# Altium schematic sheet 万年历.SchDoc
size A4
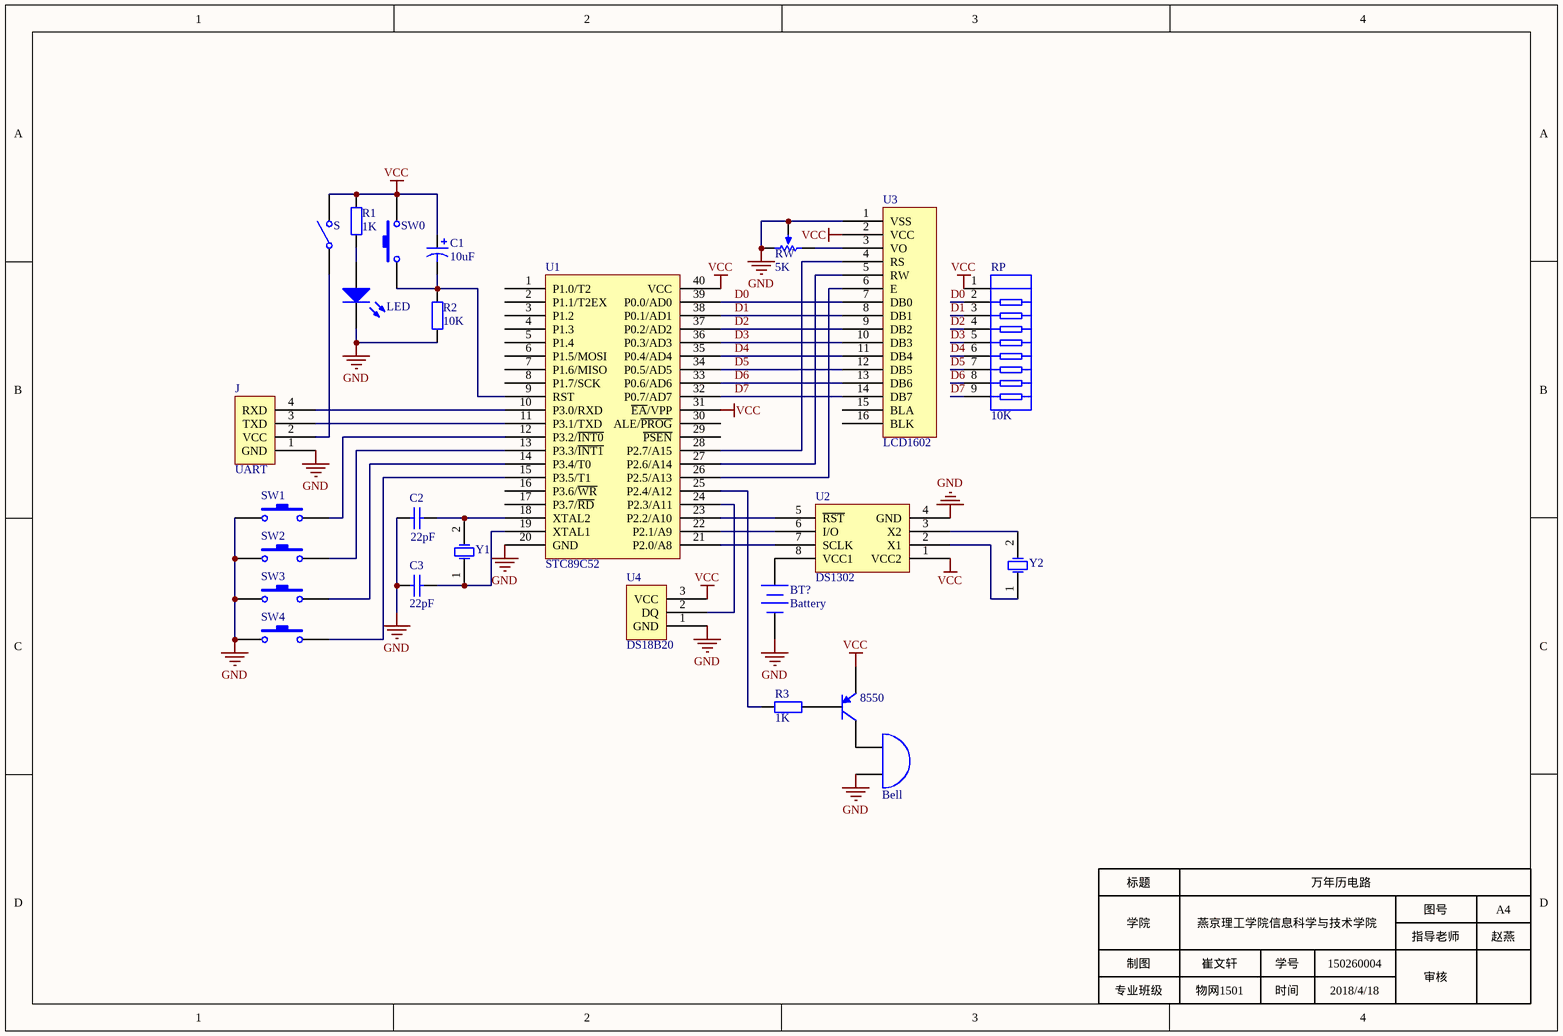
[diagram p0: 万年历.SchDoc]

## Parts
10K  RP  [HDR1X9]
8550  2N3906  [SOT_23_BCE]  (value not drawn)
?  LED  [1206-LED]
BT?  Battery  [BAT-2]
C1  value 10uF  [c+]  (hidden comment: Cap Pol1)
C2  value 22pF  [0805-C]  (hidden comment: Cap)
C3  value 22pF  [0805-C]  (hidden comment: Cap)
J  UART  [HDR1X4]
LS?  Bell  [RB7.6-15]
R1  value 1K  [0805-R]  (hidden comment: Res2)
R2  value 10K  [0805-R]  (hidden comment: Res2)
R3  value 1K  [0805-R]  (hidden comment: Res2)
RW  value 5K  [VR5]  (hidden comment: RPot)
S  SW-SPST  [KEY]  (value not drawn)
SW0  SW-PB  [SW]  (value not drawn)
SW1  SW-PB  [SW]  (value not drawn)
SW2  SW-PB  [SW]  (value not drawn)
SW3  SW-PB  [SW]  (value not drawn)
SW4  SW-PB  [SW]  (value not drawn)
U1  STC89C52  [STC89C52]
U2  DS1302  [SO8_N]
U3  LCD1602  [LCD1602]
U4  DS18B20  [HDR1X3]
Y1  XTAL  [XTAL-11.0592M]  (value not drawn)
Y2  XTAL  [XTAL-32.768K]  (value not drawn)

## Nets
GND: ?.2(K) BT?.2(-) C2.1 C3.1 J.1(GND) LS?.2(B) R2.2 RW.2(BOT) RW.3(TAP) SW1.1 SW2.1 SW3.1 SW4.1 U1.20(GND) U2.4(GND) U3.1(VSS) U4.1(GND)
VCC: 10K.1 8550.1(E) C1.1 R1.2 S.2(NO) SW0.2 U1.31(~{EA}/VPP) U1.40(VCC) U2.1(VCC2) U3.2(VCC) U4.3(VCC)
D0: 10K.2 U1.39(P0.0/AD0) U3.7(DB0)
D1: 10K.3 U1.38(P0.1/AD1) U3.8(DB1)
D2: 10K.4 U1.37(P0.2/AD2) U3.9(DB2)
D3: 10K.5 U1.36(P0.3/AD3) U3.10(DB3)
D4: 10K.6 U1.35(P0.4/AD4) U3.11(DB4)
D5: 10K.7 U1.34(P0.5/AD5) U3.12(DB5)
D6: 10K.8 U1.33(P0.6/AD6) U3.13(DB6)
D7: 10K.9 U1.32(P0.7/AD7) U3.14(DB7)
Net8550_2: 8550.2(B) R3.1
Net8550_3: 8550.3(C) LS?.1(A)
Net?_1: ?.1(A) R1.1
NetBT?_1: BT?.1(+) U2.8(VCC1)
NetC1_2: C1.2 R2.1 SW0.1 U1.9(RST)
NetC2_2: C2.2 U1.18(XTAL2) Y1.2(OSC2)
NetC3_2: C3.2 U1.19(XTAL1) Y1.1(OSC1)
NetJ_2: J.2(VCC) S.1(COMMON)
NetJ_3: J.3(TXD) U1.11(P3.1/TXD)
NetJ_4: J.4(RXD) U1.10(P3.0/RXD)
NetR3_2: R3.2 U1.25(P2.4/A12)
NetRW_1: RW.1(TOP) U3.3(VO)
NetSW1_2: SW1.2 U1.12(P3.2/~{INT0})
NetSW2_2: SW2.2 U1.13(P3.3/~{INT1})
NetSW3_2: SW3.2 U1.14(P3.4/T0)
NetSW4_2: SW4.2 U1.15(P3.5/T1)
NetU1_21: U1.21(P2.0/A8) U2.7(SCLK)
NetU1_22: U1.22(P2.1/A9) U2.6(I/O)
NetU1_23: U1.23(P2.2/A10) U2.5(~{RST})
NetU1_24: U1.24(P2.3/A11) U4.2(DQ)
NetU1_26: U1.26(P2.5/A13) U3.6(E)
NetU1_27: U1.27(P2.6/A14) U3.5(RW)
NetU1_28: U1.28(P2.7/A15) U3.4(RS)
NetU2_2: U2.2(X1) Y2.1(OSC1)
NetU2_3: U2.3(X2) Y2.2(OSC2)

Not connected (* = marked no-connect by the designer): U1 1(P1.0/T2) 2(P1.1/T2EX) 3(P1.2) 4(P1.3) 5(P1.4) 6(P1.5/MOSI) 7(P1.6/MISO) 8(P1.7/SCK) 16(P3.6/~{WR}) 17(P3.7/~{RD}) 29(~{PSEN}) 30(ALE/~{PROG}); U3 15(BLA) 16(BLK)

## Notes on the sheet
- 标题
- 学院
- 燕京理工学院信息科学与技术学院
- 万年历电路
- 图号
- A4
- 制图
- 专业班级
- 崔文轩
- 物网1501
- 学号
- 时间
- 150260004
- 2018/4/18
- 指导老师
- 审核
- 赵燕

## Library data of the parts
8550 = 2N3906: PNP General Purpose Amplifier; Published: 8-Jun-2000; LatestRevisionDate: 15-Jan-2003; LatestRevisionNote: PCB Footprint 'BCY-W3/D4.7' replaced; DatasheetVersion: 1997; PackageVersion: Sep-1998; PackageReference: TO-92A; Publisher: Altium Limited; PackageDescription: TO, Flat Index; 3 In-Line, Axial Leads; Body Dia. 4.5mm; Leads 0.51 x 0.48 mm (max); ComponentLink1Description: Manufacturer Link; ComponentLink1URL: http://www.fairchildsemi.com/; ComponentLink2Description: Datasheet; ComponentLink2URL: http://www.fairchildsemi.com/ds/2N%2F2N3906.pdf
? = LED0: Typical INFRARED GaAs LED; Published: 8-Jun-2000; LatestRevisionDate: 08-Jul-2005; LatestRevisionNote: Mech Layer 1 removed.; PackageReference: LED-0; Publisher: Altium Limited; PackageDescription: LED; 2 Leads
BT? = Battery: Multicell Battery; Published: 24-Mar-1999; LatestRevisionDate: 17-Jul-2002; LatestRevisionNote: Re-released for DXP Platform.; PackageReference: BAT-2; Publisher: Altium Limited; PackageDescription: Battery; 2 Leads
C1 = Cap Pol1: Polarized Capacitor (Radial); Published: 8-Jun-2000; LatestRevisionDate: 17-Jul-2002; LatestRevisionNote: Re-released for DXP Platform.; PackageReference: RB7.6-15; Publisher: Altium Limited; PackageDescription: Polarized Capacitor (Radial); 2 Leads
C2 C3 = Cap: Capacitor; Published: 8-Jun-2000; LatestRevisionDate: 17-Jul-2002; LatestRevisionNote: Re-released for DXP Platform.; PackageReference: RAD-0.3; Publisher: Altium Limited; PackageDescription: Radial Cap, Thru-Hole; 2 Leads; 0.3 in Pin Spacing
LS? = Bell: Electrical Bell; Published: 24-Mar-1999; LatestRevisionDate: 17-Jul-2002; LatestRevisionNote: Re-released for DXP Platform.; PackageReference: PIN2; Publisher: Altium Limited
R1-R3 = Res2: Resistor; Published: 8-Jun-2000; LatestRevisionDate: 17-Jul-2002; LatestRevisionNote: Re-released for DXP Platform.; PackageReference: AXIAL-0.4; Publisher: Altium Limited; PackageDescription: Axial Device, Thru-Hole; 2 Leads; 0.4 in Pin Spacing
RW = RPot: Potentiometer; Sim Note: Enter the Resistance value and the set point into parameter fields.; Set Position: 0.5; Published: 8-Jun-2000; LatestRevisionDate: 17-Jul-2002; LatestRevisionNote: Re-released for DXP Platform.; PackageReference: VR5; Publisher: Altium Limited; PackageDescription: Variable Resistor, Thru-Hole; 3 Leads
S = SW-SPST: Single-Pole, Single-Throw Switch; Published: 24-Mar-1999; LatestRevisionDate: 17-Jul-2002; LatestRevisionNote: Re-released for DXP Platform.; PackageReference: SPST-2; Publisher: Altium Limited; PackageDescription: Switch; 2 Leads
SW0-SW4 = SW-PB: Switch; Published: 24-Mar-1999; LatestRevisionDate: 17-Jul-2002; LatestRevisionNote: Re-released for DXP Platform.; PackageReference: SPST-2; Publisher: Altium Limited; PackageDescription: Switch; 2 Leads
Y1 Y2 = XTAL: Crystal Oscillator; Published: 8-Jun-2000; LatestRevisionDate: 17-Jul-2002; LatestRevisionNote: Re-released for DXP Platform.; PackageReference: R38; Publisher: Altium Limited; PackageDescription: Crystal, Thru-Hole; 2 Leads; Body 3.1 x 8.2 mm (Dia.xH)